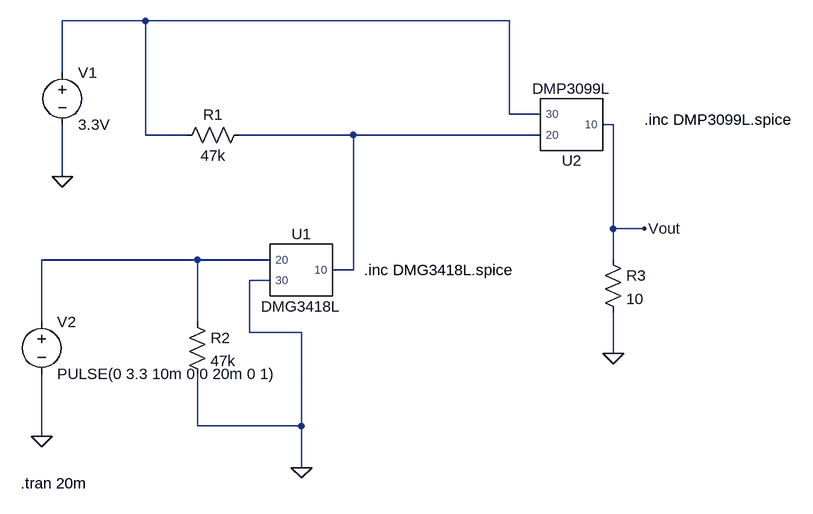
[diagram p0: schematic oled-switch.asc]
oled-switch.asc, the LTspice schematic file:
Version 4
SHEET 1 1700 680
WIRE -176 -176 -304 -176
WIRE 384 -176 -176 -176
WIRE -304 -96 -304 -176
WIRE 384 -32 384 -176
WIRE 432 -32 384 -32
WIRE 544 -16 528 -16
WIRE -176 0 -176 -176
WIRE -112 0 -176 0
WIRE 144 0 -32 0
WIRE 432 0 144 0
WIRE -304 64 -304 -16
WIRE 544 144 544 -16
WIRE 592 144 544 144
WIRE -96 192 -336 192
WIRE 16 192 -96 192
WIRE 544 192 544 144
WIRE 144 208 144 0
WIRE 144 208 112 208
WIRE 16 224 -16 224
WIRE -336 288 -336 192
WIRE -96 288 -96 192
WIRE -16 304 -16 224
WIRE 64 304 -16 304
WIRE 544 336 544 272
WIRE -96 448 -96 368
WIRE 64 448 64 304
WIRE 64 448 -96 448
WIRE -336 464 -336 368
WIRE 64 512 64 448
FLAG -304 64 0
FLAG 592 144 Vout
FLAG 64 512 0
FLAG -336 464 0
FLAG 544 336 0
SYMBOL res -16 -16 R90
WINDOW 0 0 56 VBottom 2
WINDOW 3 32 56 VTop 2
SYMATTR InstName R1
SYMATTR Value 47k
SYMBOL voltage -304 -112 R0
WINDOW 123 0 0 Left 0
WINDOW 39 0 0 Left 0
SYMATTR InstName V1
SYMATTR Value 3.3V
SYMBOL res -112 272 R0
SYMATTR InstName R2
SYMATTR Value 47k
SYMBOL voltage -336 272 R0
WINDOW 123 0 0 Left 0
WINDOW 39 0 0 Left 0
SYMATTR InstName V2
SYMATTR Value PULSE(0 3.3 10m 0 0 20m 0 1)
SYMBOL res 528 176 R0
SYMATTR InstName R3
SYMATTR Value 10
SYMBOL DMP3099L 480 -16 R180
SYMATTR InstName U2
SYMBOL DMG3418L 64 208 M0
SYMATTR InstName U1
TEXT -368 536 Left 2 !.tran 20m
TEXT 160 208 Left 2 !.inc DMG3418L.spice
TEXT 592 -24 Left 2 !.inc DMP3099L.spice

The netlist it stands for:
* oled-switch.asc
R1 N002 N001 47k
V1 N001 0 3.3V
R2 N003 0 47k
V2 N003 0 PULSE(0 3.3 10m 0 0 20m 0 1)
R3 Vout 0 10
XU2 Vout N002 N001 DMP3099L  ; pins 10 20 30
XU1 N002 N003 0 DMG3418L  ; pins 10 20 30
.tran 20m
.inc DMG3418L.spice
.inc DMP3099L.spice
.backanno
.end